# EAGLE design Solar_Panel_Support (EAGLE 9.1.3)
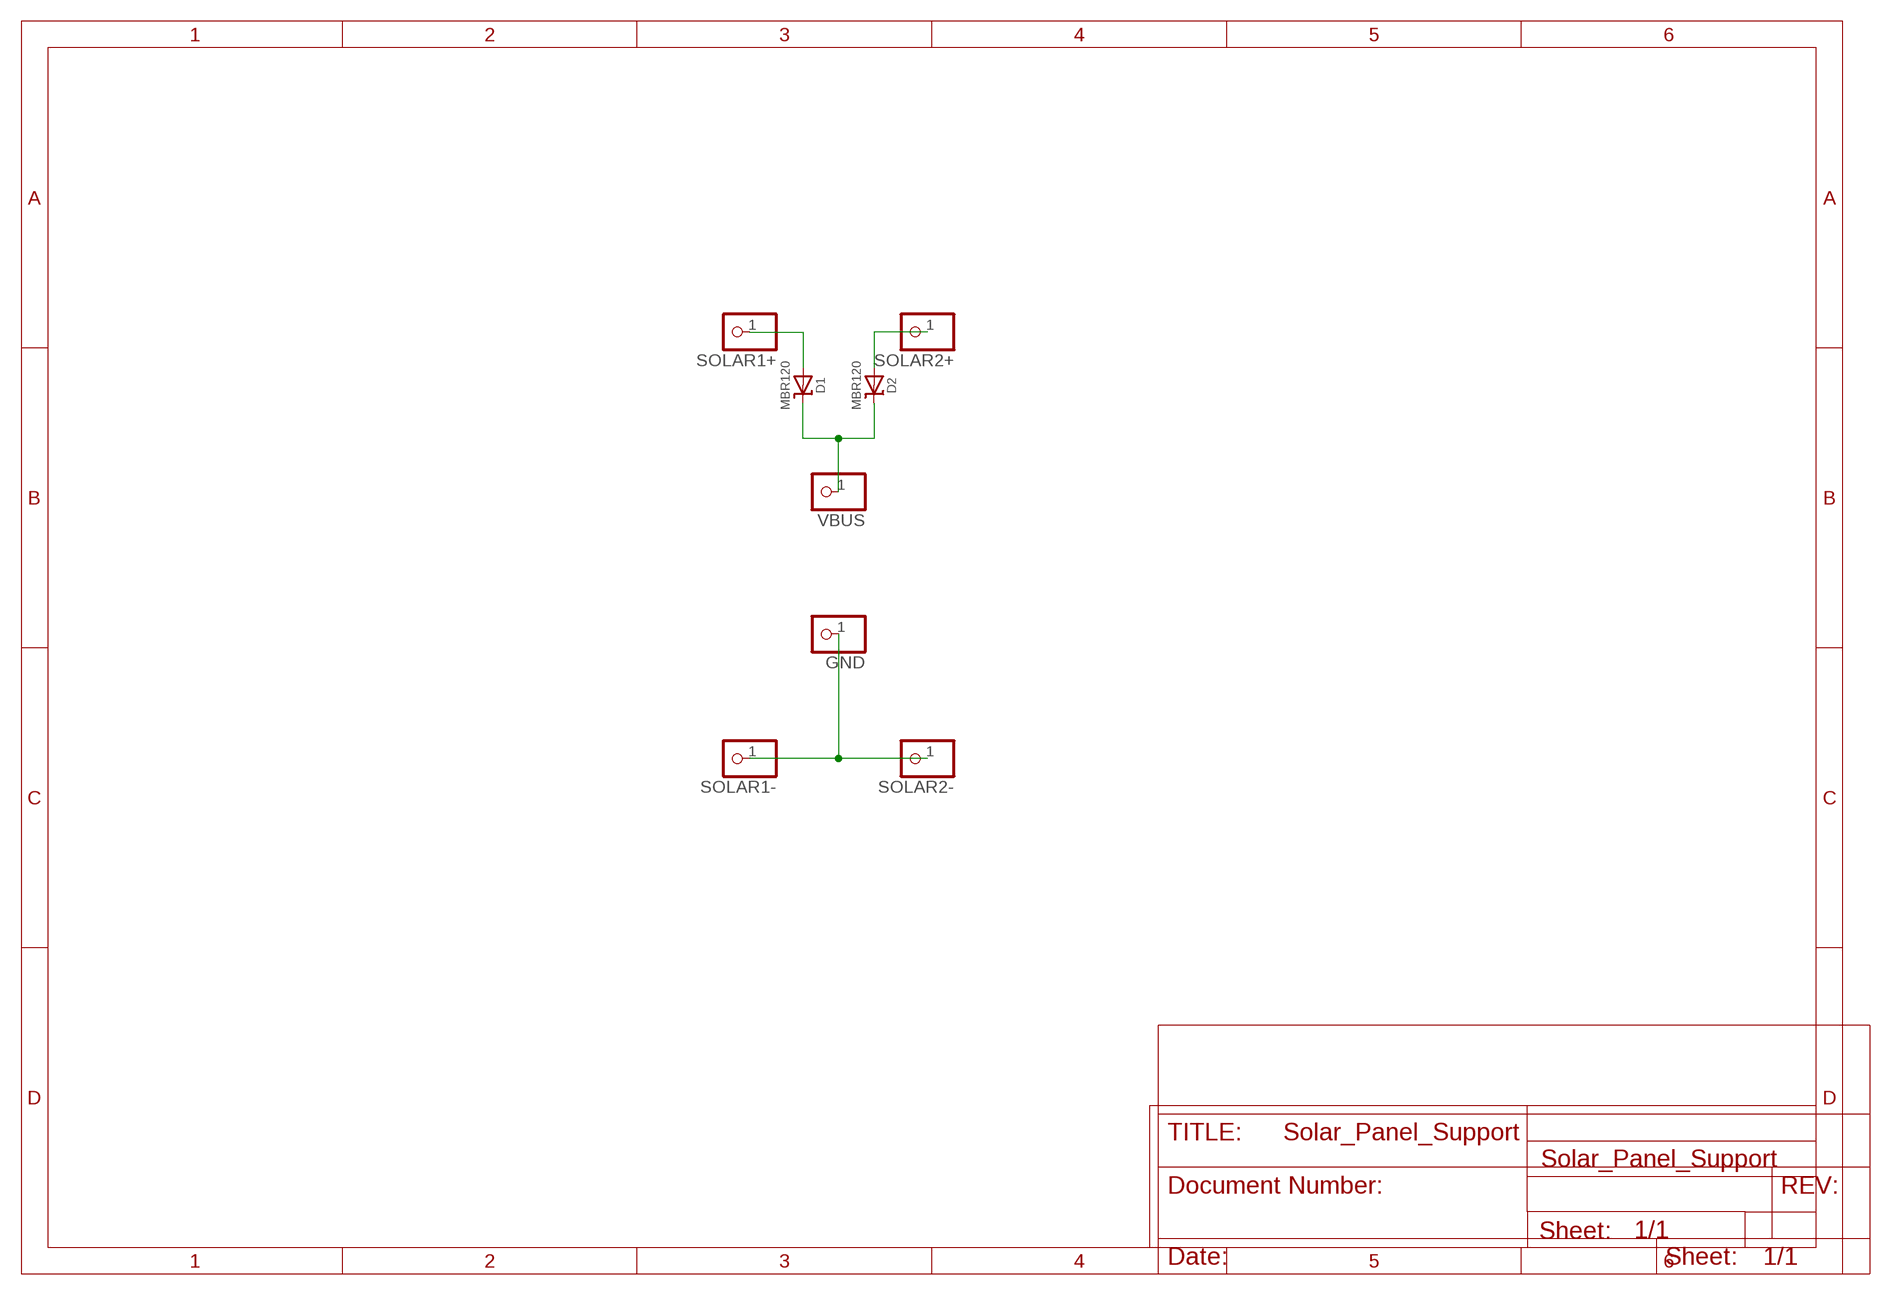
[diagram p0: schematic, sheet 1]

## Parts
D1  MBR120  DIODE-SCHOTTKYSOD-123  [SOD-123]
D2  MBR120  DIODE-SCHOTTKYSOD-123  [SOD-123]
GND  PINHD-1X1  [1X01]
SOLAR1+  PINHD-1X1  [1X01]
SOLAR1-  PINHD-1X1  [1X01]
SOLAR2+  PINHD-1X1  [1X01]
SOLAR2-  PINHD-1X1  [1X01]
VBUS  PINHD-1X1  [1X01]

## Nets
N$1: D2.A SOLAR2+.1
N$2: D1.C D2.C VBUS.1
N$3: GND.1 SOLAR1-.1 SOLAR2-.1
N$14: D1.A SOLAR1+.1

## Library data of the parts
D1 D2 = microbuilder:DIODE-SCHOTTKY
GND SOLAR1+ SOLAR1- SOLAR2+ SOLAR2- VBUS = adafruit:PINHD-1X1: Pin header 1x1 for 0.1" spacing With round pins

## Board
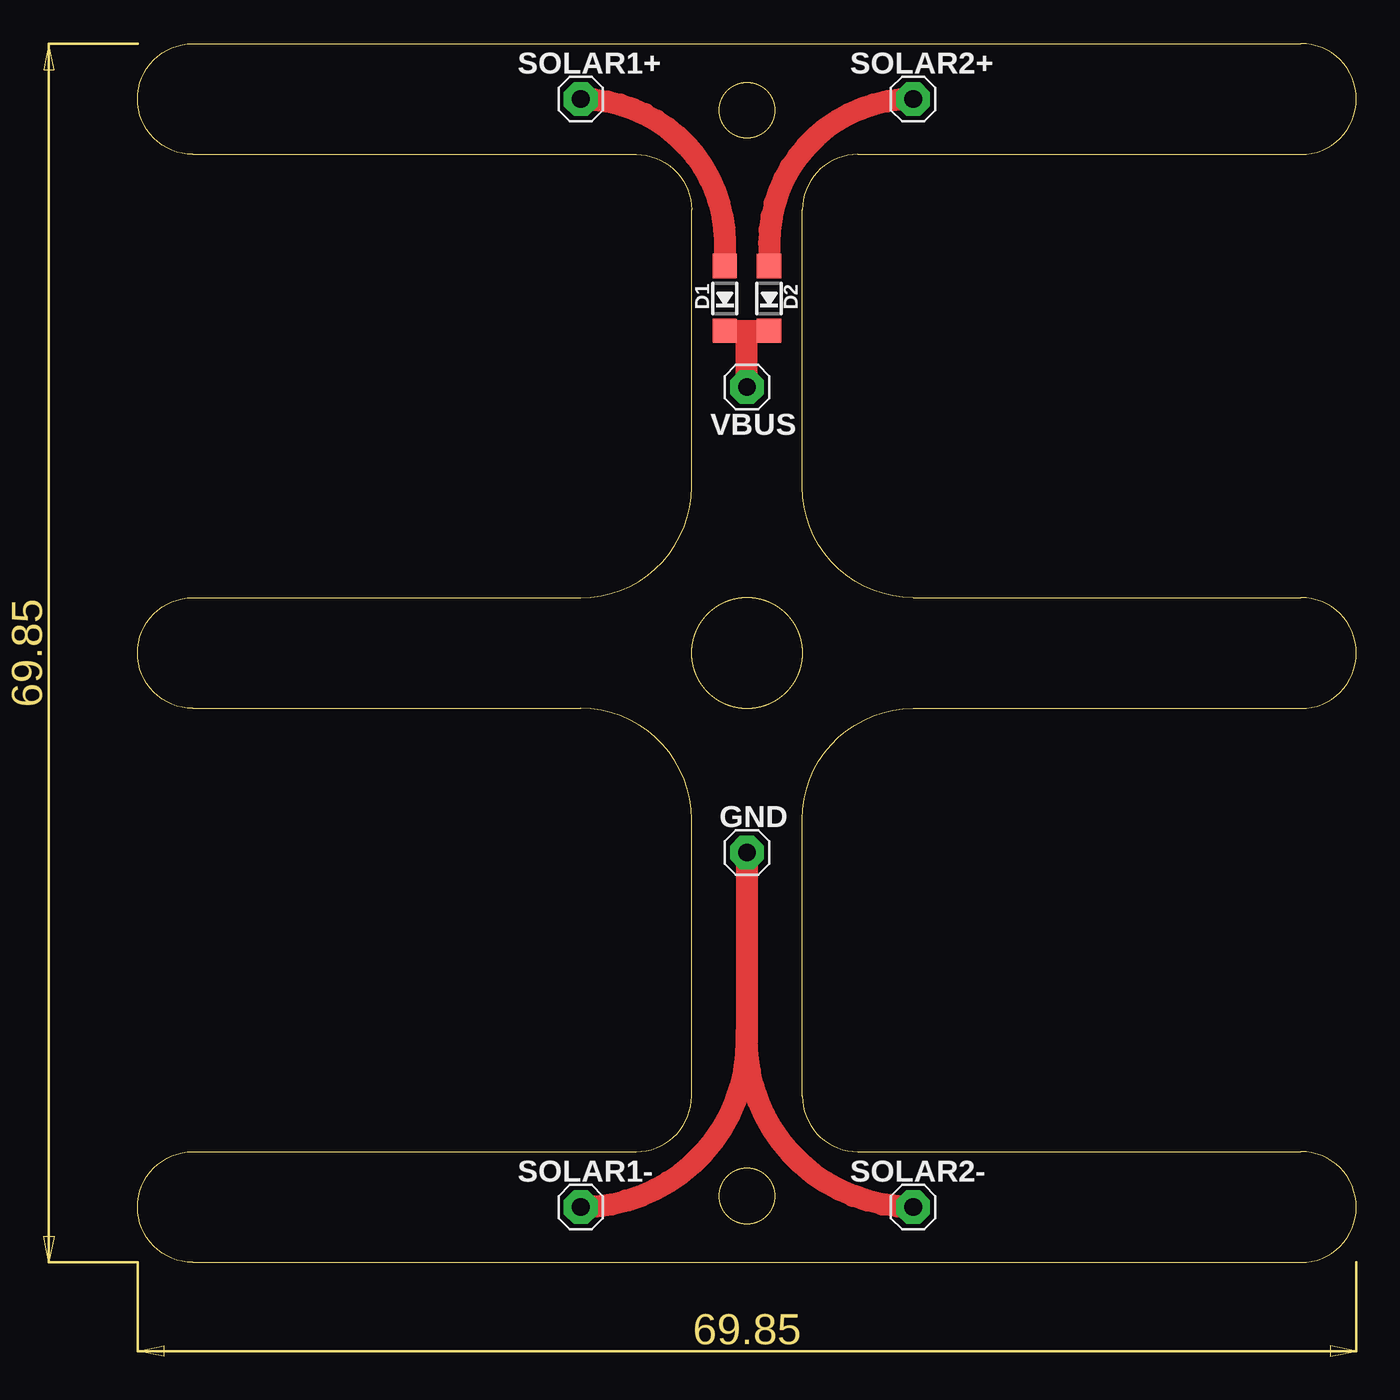
[diagram p1: board, top side]

Size 69.85 x 69.85 mm. Coordinates in mm from the lower left corner, seen from the top.
Outline: 3.17,0 arc-180 3.17,6.35 28.57,6.35 arc90 31.75,9.53 31.75,25.4 arc90 25.4,31.75 3.17,31.75 arc-180 3.17,38.1 25.4,38.1 arc90 31.75,44.45 31.75,60.33 arc90 28.57,63.5 3.17,63.5 arc-180 3.17,69.85 66.67,69.85 arc-180 66.67,63.5 41.27,63.5 arc90 38.1,60.33 38.1,44.45 arc90 44.45,38.1 66.67,38.1 arc-180 66.67,31.75 44.45,31.75 arc90 38.1,25.4 38.1,9.53 arc90 41.27,6.35 66.67,6.35 arc-180 66.67,0 3.17,0
Outline: circle at 34.92,34.92 radius 3.17
Outline: circle at 34.92,3.81 radius 1.59
Outline: circle at 34.92,66.04 radius 1.59
Copper layers (1*16): Top 0.018mm / dielectric 1.55mm / Bottom 0.018mm
Design rules "Multi-CB_2L_125um-Tracks_OL35um": minimum track width 0.125mm, minimum drill 0.2mm, track to track 0.125mm, track to pad 0.125mm, pad to pad 0.125mm, via to via 0.125mm, smd to smd 0mil, copper to edge 0.2mm, drill to drill 0.2mm, minimum pad ring 0.125mm, minimum via ring 0.125mm, stop-mask expansion 2mil, vias tented up to drill 0.45mm, thermal gap 0.2mm

### Footprints (pad centres in the part's own frame; a part is rotated, then mirrored left to right if it is on the bottom)
SOD-123 = smd 1.4 x 1.4: A 1.85,0; C -1.85,0
1X01 = drill 1.016 pad 1.93 octagon: 1 0,0

### Placement (x,y rotation side)
D1  33.66,55.24 90 top
D2  36.2,55.24 90 top
GND  34.92,23.5 0 top
SOLAR1+  25.4,66.67 0 top
SOLAR1-  25.4,3.17 0 top
SOLAR2+  44.45,66.67 0 top
SOLAR2-  44.45,3.17 0 top
VBUS  34.92,50.16 0 top

### Tracks (layer width: path | path; a pad name or v marks a point on that pad's centre or on a via)
N$1
  Top 1.27: SOLAR2+.1 arc90 36.2,58.42 D2.A
N$2
  Top 1.27: D1.C 34.92,53.4 | 34.92,53.4 D2.C | VBUS.1 34.92,53.4
N$3
  Top 1.27: SOLAR1-.1 arc90 34.92,12.7 | 34.92,13.34 34.92,12.7 | SOLAR2-.1 arc-90 34.92,12.7 | 34.92,12.7 34.92,13.34 | GND.1 34.92,13.34
N$14
  Top 1.27: SOLAR1+.1 arc-90 33.66,58.42 D1.A